# Altium schematic sheet regulators.SchDoc
size A4; SheetNumber: 5; SheetTotal: 6
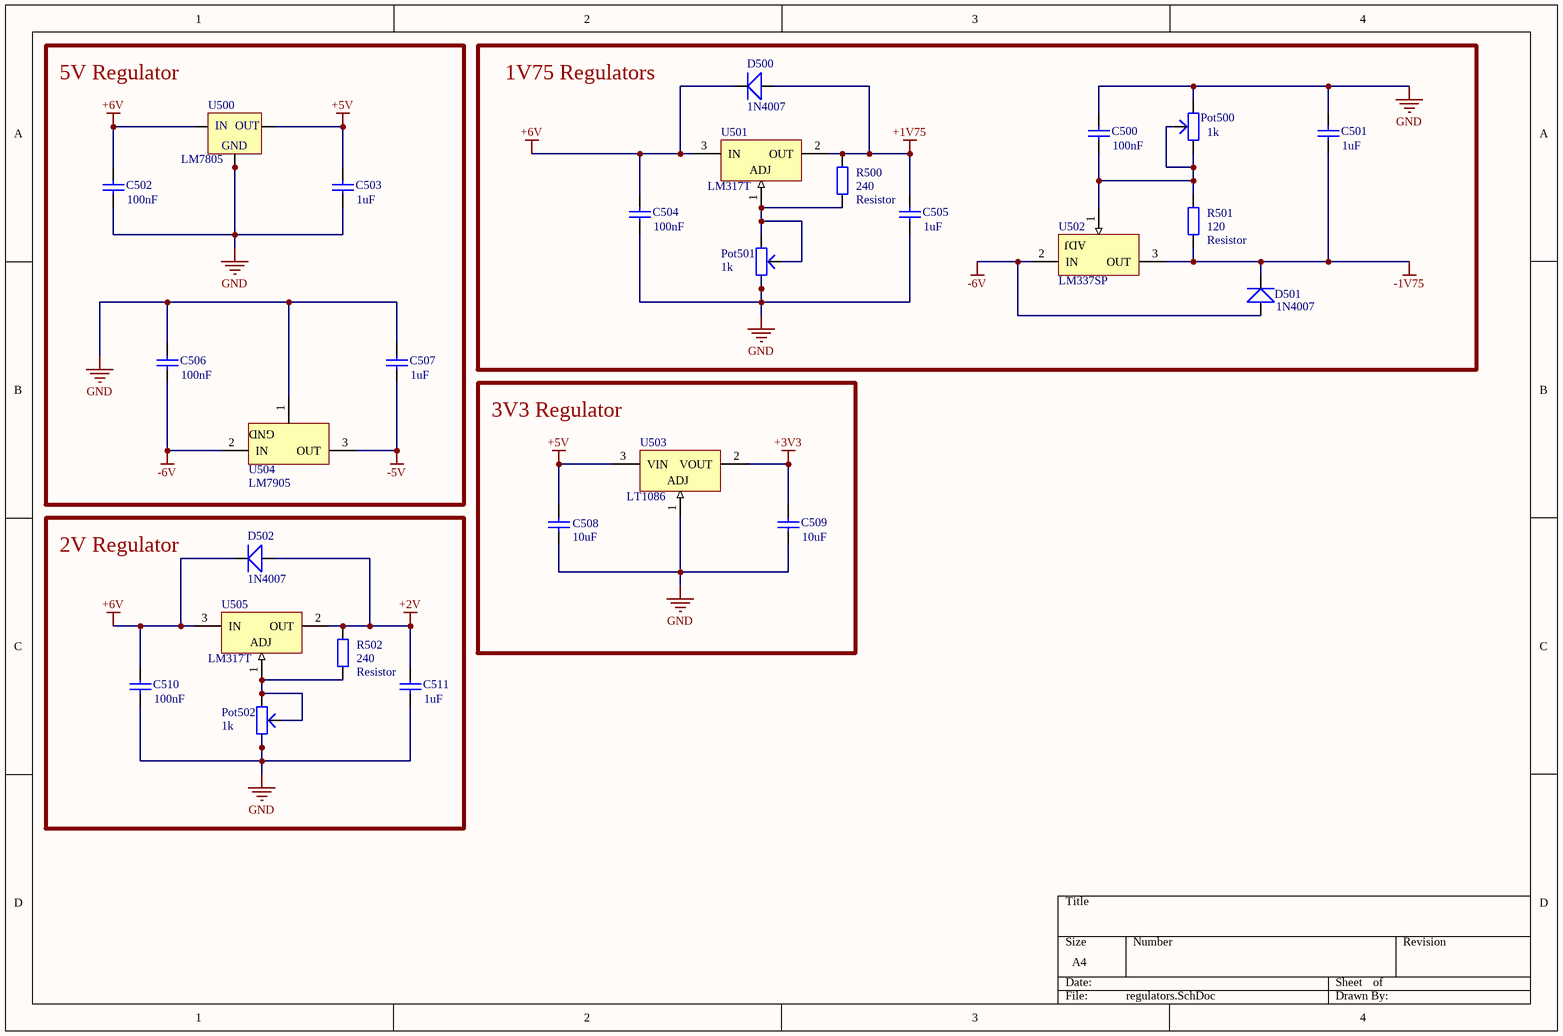
[diagram p0: regulators.SchDoc]

## Parts
C500  value 100nF  [Cap-1]  (hidden comment: Cap)
C501  value 1uF  [Cap-1]  (hidden comment: Cap)
C502  value 100nF  [Cap-1]  (hidden comment: Cap)
C503  value 1uF  [Cap-1]  (hidden comment: Cap)
C504  value 100nF  [Cap-1]  (hidden comment: Cap)
C505  value 1uF  [Cap-1]  (hidden comment: Cap)
C506  value 100nF  [Cap-1]  (hidden comment: Cap)
C507  value 1uF  [Cap-1]  (hidden comment: Cap)
C508  value 10uF  [Cap-1]  (hidden comment: Cap)
C509  value 10uF  [Cap-1]  (hidden comment: Cap)
C510  value 100nF  [Cap-1]  (hidden comment: Cap)
C511  value 1uF  [Cap-1]  (hidden comment: Cap)
D500  1N4007  [1N4007]
D501  1N4007  [1N4007]
D502  1N4007  [1N4007]
Pot500  value 1k  [Pot trim slim high]  (hidden comment: Pot Trim)
Pot501  value 1k  [Pot trim slim high]  (hidden comment: Pot Trim)
Pot502  value 1k  [Pot trim slim high]  (hidden comment: Pot Trim)
R500  Resistor  value 240  [RES THT 9mm]
R501  Resistor  value 120  [RES THT 9mm]
R502  Resistor  value 240  [RES THT 9mm]
U500  LM7805  [TO-220]
U501  LM317T  [TO-220]
U502  LM337SP  [TO220]
U503  LT1086  [LT-T-3]
U504  LM7905  [NDE0003A]
U505  LM317T  [TO-220]

## Blocks framed on the sheet
5V Regulator: C502 C503 C506 C507 U500 U504
1V75 Regulators: C500 C501 C504 C505 D500 D501 Pot500 Pot501 R500 R501 U501 U502
3V3 Regulator: C508 C509 U503
2V Regulator: C510 C511 D502 Pot502 R502 U505

## Nets
+1V75: C505.2(g) D500.1 R500.2 U501.2(OUT)
+2V: C511.2(g) D502.1 R502.2 U505.2(OUT)
+3V3: C509.2(g) U503.2(VOUT)
+5V: C503.2(g) C508.2(g) U500.3(OUT) U503.3(VIN)
+6V: C502.2(g) C504.2(g) C510.2(g) D500.2 D502.2 U500.1(IN) U501.3(IN) U505.3(IN)
-1V75: C501.1 D501.2 R501.1 U502.3(OUT)
-5V: C507.1 U504.3(OUT)
-6V: C506.1 D501.1 U502.2(IN) U504.2(IN)
GND: C500.2(g) C501.2(g) C502.1 C503.1 C504.1 C505.1 C506.2(g) C507.2(g) C508.1 C509.1 C510.1 C511.1 Pot500.1 Pot501.1 Pot502.1 U500.2(GND) U500.4(GND) U503.1(ADJ) U504.1(GND)
NetC500_1: C500.1 Pot500.2 Pot500.3 R501.2 U502.1(ADJ)
NetPot501_2: Pot501.2 Pot501.3 R500.1 U501.1(ADJ)
NetPot502_2: Pot502.2 Pot502.3 R502.1 U505.1(ADJ)

## Library data of the parts
C500-C511 = Capacitor 1 space
Pot500-Pot502 = Pot Trim: Potentiometer
U500 = Voltage Regulator: pin to pad: 4>2
U501 U505 = CMP-0244-00444-1: 1.5A, 1.2V to 37V Adjustable Voltage Regulator, 3-Pin TO-220; PackageVersion: 2011; ComponentLink1URL: http://www.st.com; ComponentLink2URL: http://www.st.com/internet/com/TECHNICAL_RESOURCES/TECHNICAL_LITERATURE/DATASHEET/CD00000455.pdf; PackageDescription: TO, Thru-Hole, Vertical, Heatsink Mounted; 3 In-Line Leads; Pitch 2.54 mm; PackageReference: TO-220; ComponentLink1Description: Manufacturer URL; ComponentLink3URL: http://www.st.com/internet/com/TECHNICAL_RESOURCES/TECHNICAL_LITERATURE/PACKAGE_INFORMATION/CD00004649.pdf; DatasheetVersion: 1/11/2011; ComponentLink2Description: Datasheet; ComponentLink3Description: Package Specification
U502 = CMP-0244-00420-1: Three-Terminal Negative Voltage Regulator, 3-Pin TO-220; PackageReference: TO220; DatasheetVersion: 1/10/2011; ComponentLink3Description: Package Specification; ComponentLink3URL: http://www.st.com/internet/com/TECHNICAL_RESOURCES/TECHNICAL_LITERATURE/PACKAGE_INFORMATION/CD00004649.pdf; PackageDescription: TO, Thru-Hole, Vertical, Heatsink Mounted; 3 In-Line Leads; Pitch 2.54 mm; PackageVersion: ver3.0; ComponentLink1Description: Manufacturer URL; ComponentLink1URL: http://www.st.com; ComponentLink2Description: Datasheet; ComponentLink2URL: http://www.st.com/internet/com/TECHNICAL_RESOURCES/TECHNICAL_LITERATURE/DATASHEET/CD00000468.pdf
U503 = CMP-0476-01904-1: 1.5 A Low Dropout Positive Regulator, 2.55 to 25 V Vin, Adjustable Vout, 3-pin FM (T-3), 0 to 150 degC, Pb-Free; Manufacturer: Linear Technology; PartNumber: LT1086CT#PBF; Vout Min(V): 1.25; Iout(mA): 1500; Dropout Voltage(V): 1.3; Output Voltage: Adj; Vout Max(V): 23.5; PSRR(dB): 75; Vin Max(V): 25; Number of Outputs: 1; Isupply(mA): 5; Discrete Pass Element: no; Vin Min(V): 2.55; ComponentLink3URL: http://cds.linear.com/docs/en/packaging/TO-220_3_05-08-1420.pdf; PackageVersion: Jun-10; ComponentLink1URL: http://www.linear.com/; ComponentLink2Description: Datasheet; PackageReference: T-3; RoHS: TRUE; ComponentLink2URL: http://cds.linear.com/docs/en/datasheet/1086ffs.pdf; DatasheetVersion: Rev. F; Mounting Technology: Through Hole; ComponentLink3Description: Package Specification; ComponentLink1Description: Manufacturer URL; PackageDescription: 3-Pin Plastic TO-220, Body 10.2235 x 4.3815 mm, Pitch 2.54 mm
U504 = CMP-0062-02481-3: 3-Terminal Negative Regulator, 3-pin TO-220, Pb-Free; Manufacturer: Texas Instruments; PackageTopMarking: NSUZXYTTE#*LM7905CT; CompType: LDO IC; PowerWise: N; PackageDescription: TO-220, Molded, 3 Lead, Straight; ComponentLink1Description: Datasheet URL; ComponentLink1URL: http://www.ti.com/general/docs/lit/getliterature.tsp?genericPartNumber=LM7905&fileType=pdf; PackageReference: NDE0003A; RoHS: Y; PinCount: 3